# EAGLE design blinking circuit training (EAGLE 6.2)
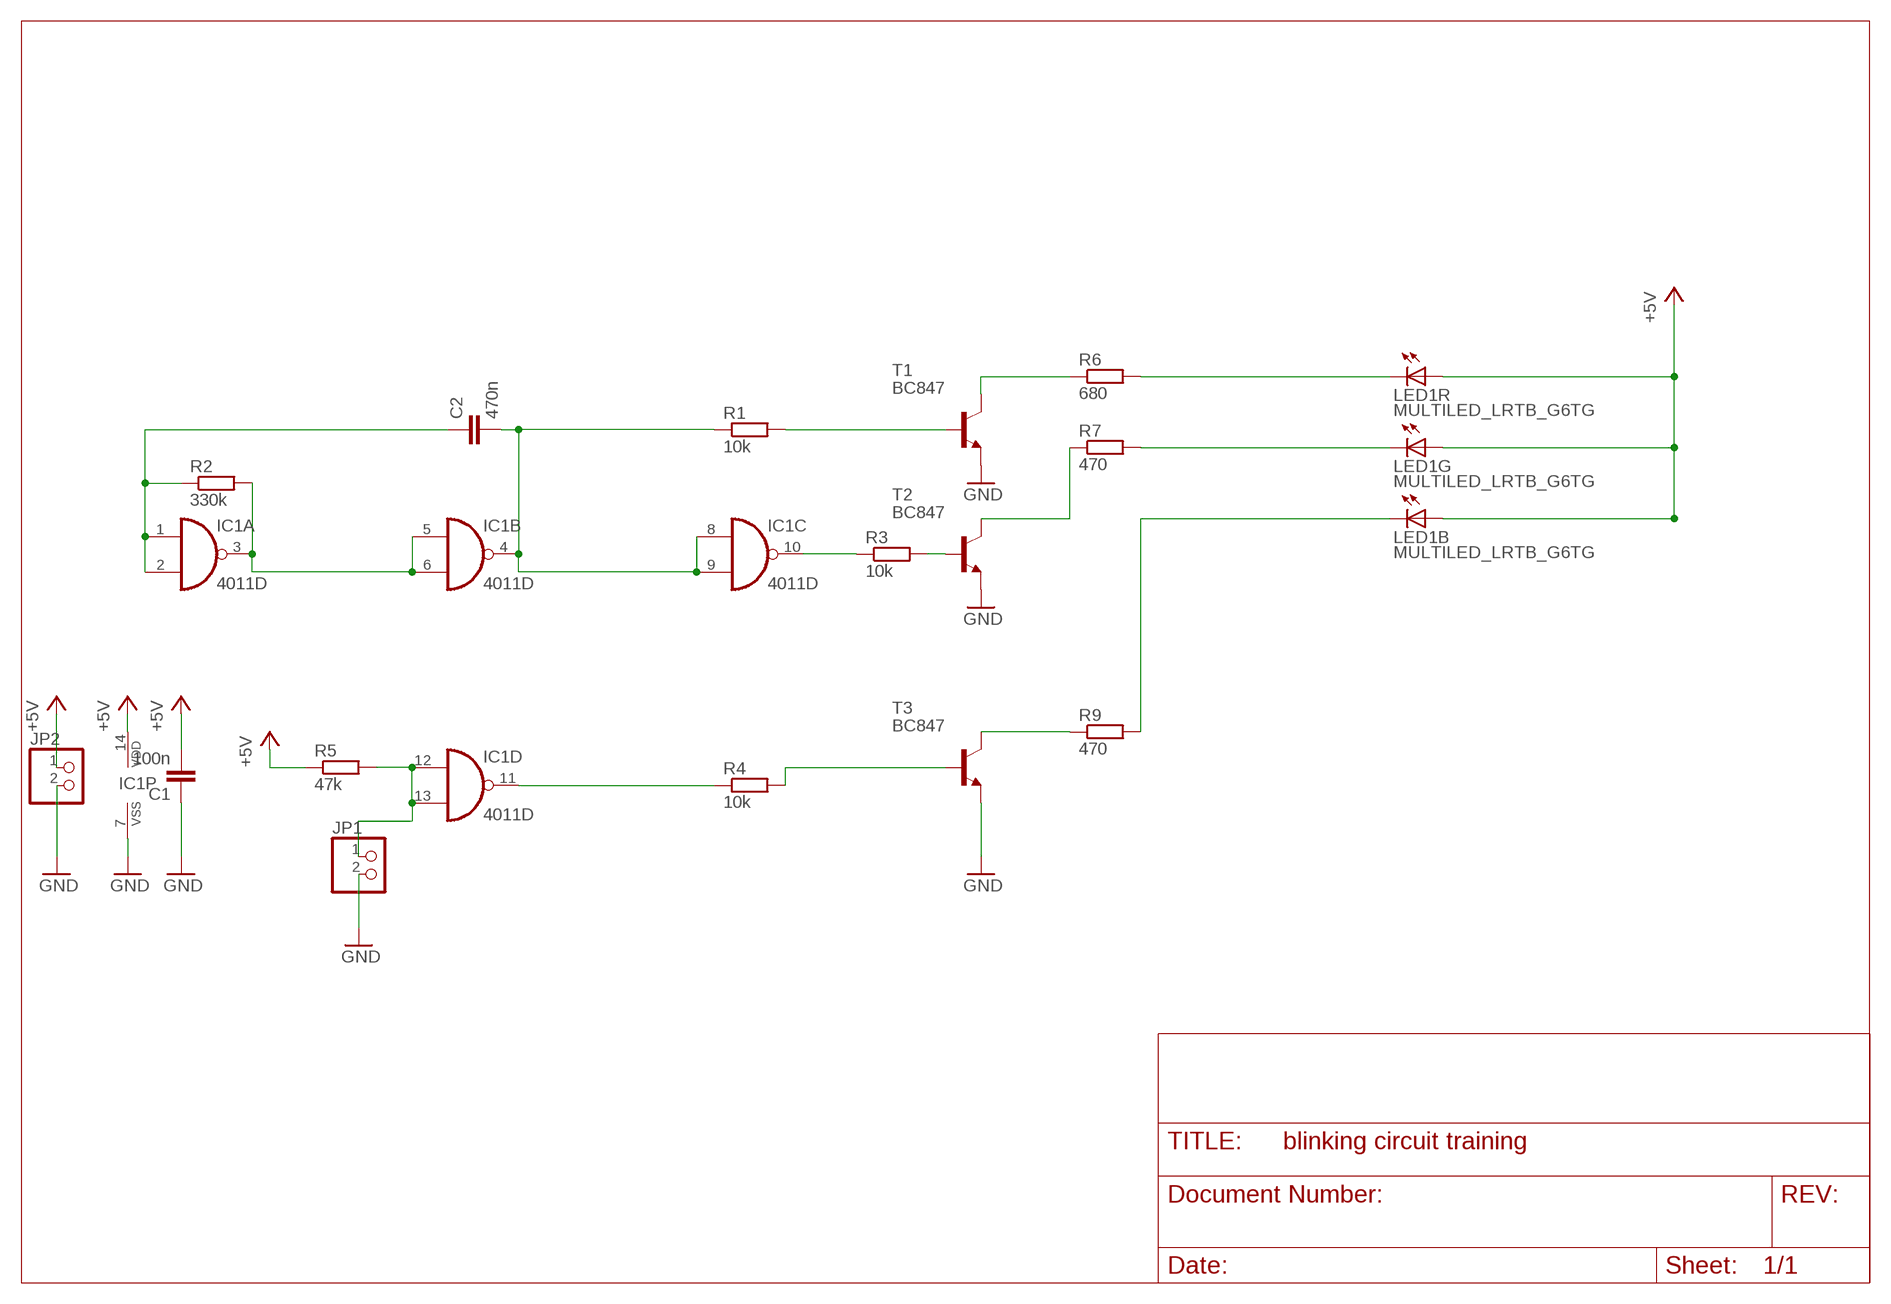
[diagram p0: schematic, sheet 1]

## Parts
C1  100n  C-EUC0603  [C0603]
C2  470n  C-EUC0603  [C0603]
IC1  4011D  [SO14]
JP1  PINHD-1X2  [1X02]
JP2  PINHD-1X2  [1X02]
LED1  MULTILED_LRTB_G6TG  [P-LCC-6_TOPLED]
R1  10k  R-EU_M1206  [M1206]
R2  330k  R-EU_M1206  [M1206]
R3  10k  R-EU_M1206  [M1206]
R4  10k  R-EU_M1206  [M1206]
R5  47k  R-EU_M1206  [M1206]
R6  680  R-EU_M1206  [M1206]
R7  470  R-EU_M1206  [M1206]
R9  470  R-EU_M1206  [M1206]
T1  BC847  [SOT23]
T2  BC847  [SOT23]
T3  BC847  [SOT23]

## Nets
+5V: C1.2 IC1.14(P:VDD) JP2.1 LED1.A1(R:A) LED1.A2(G:A) LED1.A3(B:A) R5.1
GND: C1.1 IC1.7(P:VSS) JP1.2 JP2.2 T1.2(E) T2.2(E) T3.2(E)
N$1: C2.1 IC1.1(A:I0) IC1.2(A:I1) R2.1
N$2: C2.2 IC1.4(B:O) IC1.8(C:I0) IC1.9(C:I1) R1.1
N$3: IC1.3(A:O) IC1.5(B:I0) IC1.6(B:I1) R2.2
N$4: LED1.C1(R:C) R6.2
N$5: R6.1 T1.3(C)
N$6: R7.1 T2.3(C)
N$7: R3.2 T2.1(B)
N$8: IC1.10(C:O) R3.1
N$9: R1.2 T1.1(B)
N$10: R9.1 T3.3(C)
N$12: IC1.11(D:O) R4.1
N$13: R4.2 T3.1(B)
N$14: LED1.C2(G:C) R7.2
N$15: LED1.C3(B:C) R9.2
N$16: IC1.12(D:I0) IC1.13(D:I1) JP1.1 R5.2

## Library data of the parts
C1 C2 = rcl:C-EU: CAPACITOR, European symbol
IC1 = 40xx:4011: Quad 2-input NAND
JP1 JP2 = pinhead:PINHD-1X2: PIN HEADER
LED1 = led:MULTILED_LRTB_G6TG: 6-lead MULTILED® Enhanced optical Power LED (ThinFilm® / ThinGaN®) Source. OSRAM - LRTB_G6TG.pdf
R1-R7 R9 = rcl:R-EU_: RESISTOR, European symbol
T1-T3 = transistor:BC847: NPN TRANSISTOR

## Board
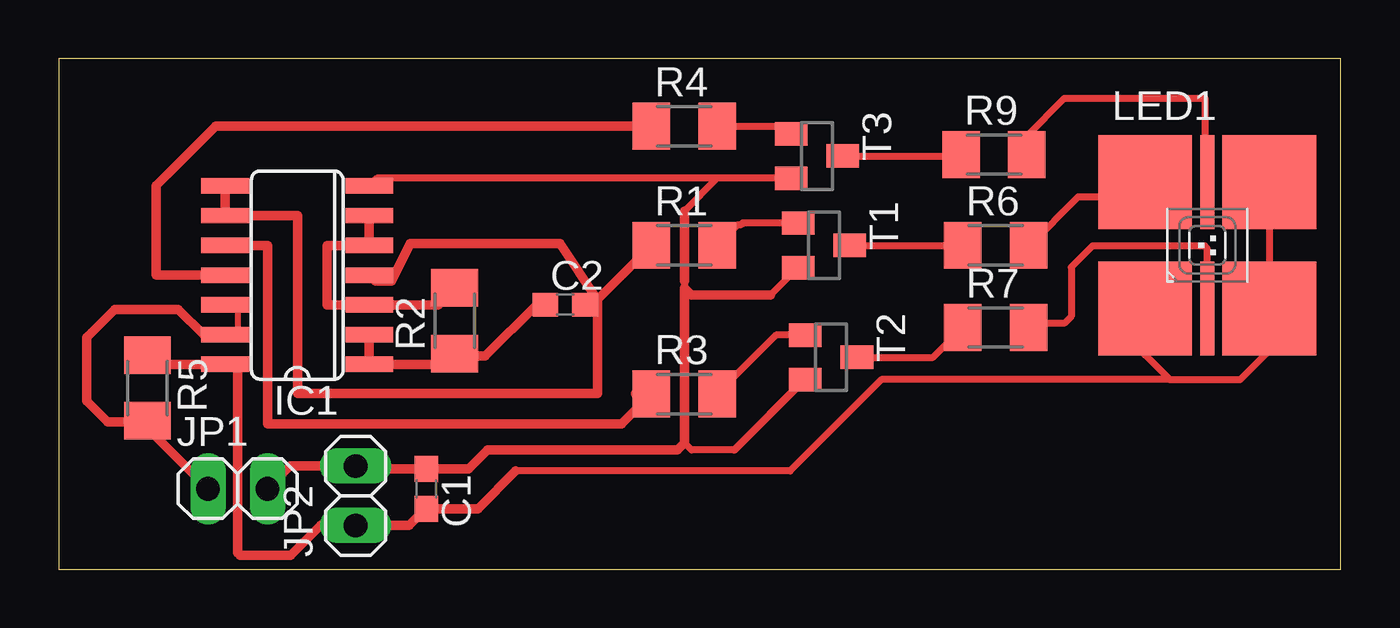
[diagram p1: board, top side]

Size 54.7 x 21.8 mm. Coordinates in mm from the lower left corner, seen from the top.
Outline: 0,0 54.7,0 54.7,21.8 0,21.8 0,0
Copper layers (1*16): Top 0.035mm / dielectric 1.5mm / Bottom 0.035mm
Design rules: minimum track width 10mil, minimum drill 24mil, track to track 8mil, track to pad 8mil, pad to pad 8mil, via to via 8mil, smd to smd 8mil, copper to edge 40mil, drill to drill 8mil, minimum pad ring 10mil, minimum via ring 8mil, stop-mask expansion 4mil, vias tented up to drill 0mil, thermal gap 10mil

### Footprints (pad centres in the part's own frame; a part is rotated, then mirrored left to right if it is on the bottom)
C0603 = smd 1.1 x 1: 1 -0.85,0; 2 0.85,0
SO14 = smd 0.66 x 2.032: 1 -3.81,-3.073; 2 -2.54,-3.073; 3 -1.27,-3.073; 4 0,-3.073; 5 1.27,-3.073; 6 2.54,-3.073; 7 3.81,-3.073; 8 3.81,3.073; 9 2.54,3.073; 10 1.27,3.073; 11 0,3.073; 12 -1.27,3.073; 13 -2.54,3.073; 14 -3.81,3.073
1X02 = drill 1.016 long: 1 -1.27,0; 2 1.27,0
P-LCC-6_TOPLED = smd 4 x 4: A1 -2.65,-2.7; A2 2.65,-2.7; A3 2.65,2.7; C1 -2.65,2.7 | smd 0.6 x 4: C2 0,-2.7; C3 0,2.7
M1206 = smd 1.6 x 2: 1 -1.4,0; 2 1.4,0
SOT23 = smd 1 x 1.4: 1 -0.95,-1.1; 2 0.95,-1.1; 3 0,1.1

### Placement (x,y rotation side)
C1  15.68,3.44 270 top
C2  21.61,11.29 0 top
IC1  10.18,12.56 90 top
JP1  7.64,3.44 0 top
JP2  12.67,3.14 90 top
LED1  49,13.83 0 top
R1  26.69,13.83 0 top
R2  16.9,10.61 90 top
R3  26.69,7.48 0 top
R4  26.69,18.91 0 top
R5  3.79,7.74 270 top
R6  39.97,13.83 0 top
R7  39.97,10.32 0 top
R9  39.9,17.7 0 top
T1  32.65,13.83 270 top
T2  32.95,9.05 270 top
T3  32.35,17.64 270 top

### Tracks (layer width: path | path; a pad name or v marks a point on that pad's centre or on a via)
+5V
  Top 0.305: LED1.A3 LED1.A2 51.6,11.08 51.6,9.3 50.4,8.1 47.4,8.1 | LED1.A1 46.35,9.15 47.4,8.1 | 47.4,8.1 35.1,8.1 31.2,4.2 19.5,4.2
  Top 0.406: 19.5,4.2 17.89,2.59 C1.2 14.96,1.87 JP2.1 11.17,1.87 9.9,0.6 7.75,0.6 7.64,0.7 7.65,4.87 7.64,8.29 7.66,8.83 IC1.14 4.18,8.75 arc-90 R5.1
GND
  Top 0.305: JP1.2 9.14,3.44 | 28.8,5.1 28.85,5.1 T2.2 31.8,8.1 28.8,5.1 | IC1.7 13.57,16.69 T3.2 28.09,16.69 26.7,15.3 | 26.7,12.3 26.7,12 | 30.37,11.7 T1.2 | 28.8,5.1 27,5.1 26.7,5.4
  Top 0.406: 26.7,15.3 26.7,12.3 | 30.37,11.7 27,11.7 26.7,12 26.7,5.4 26.4,5.1 18.3,5.1 17.49,4.29 C1.1 12.79,4.29 JP2.2 9.88,4.41 JP1.2
N$1
  Top 0.406: IC1.2 IC1.1 16.44,8.75 R2.1 17.01,9.1 18.2,9.1 20.39,11.29 C2.1
N$2
  Top 0.406: R1.1 22.75,11.29 C2.2 22.79,11.29 23,11.5 | IC1.8 IC1.9 10.2,15.1 10.2,7.5 23,7.5 23,11.5 | 23,11.5 21.4,13.9 15,13.9 14.2,12.3 13.51,12.3 IC1.4
N$3
  Top 0.406: IC1.6 IC1.5 11.45,13.83 11.45,11.29 IC1.3 16.18,11.29 R2.2
N$4
  Top 0.305: R6.2 41.43,13.83 43.5,15.9 45.72,15.9 LED1.C1
N$5
  Top 0.305: T1.3 R6.1
N$6
  Top 0.305: T2.3 37.3,9.05 R7.1
N$7
  Top 0.305: T2.1 30.61,10 R3.2
N$8
  Top 0.406: IC1.10 8.91,13.83 8.91,6.21 12.12,6.2 24.01,6.2 R3.1 24.62,7.48 24.6,7.5
N$9
  Top 0.305: T1.1 29.18,14.78 29.1,14.7 28.96,14.7 R1.2
N$10
  Top 0.305: T3.3 38.44,17.64 R9.1
N$12
  Top 0.406: R4.1 6.7,18.91 4.16,16.37 4.16,12.56 IC1.11
N$13
  Top 0.305: R4.2 30.93,18.91 T3.1
N$14
  Top 0.305: LED1.C2 49,13.7 48.9,13.8 44.1,13.8 43.2,12.9 43.2,10.8 42.9,10.5 41.55,10.5 R7.2
N$15
  Top 0.305: R9.2 41.3,18.5 42.9,20.1 48.9,20.1 48.9,16.63 LED1.C3
N$16
  Top 0.254: IC1.13 7.64,10.02 7.64,11.29 IC1.12
  Top 0.406: JP1.1 3.79,6.02 R5.2 3.75,6.3 2.1,6.3 1.2,7.2 1.2,9.9 2.4,11.1 5.1,11.1 6.18,10.02 IC1.13